# EAGLE schematic XbeeBoard (EAGLE 7.2.0)
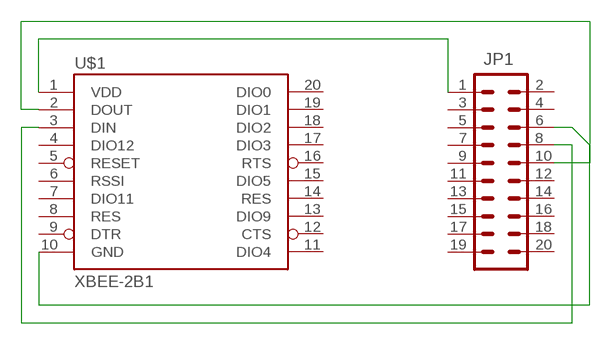
[diagram p0: schematic, sheet 1]

## Parts
JP1  M10X2  [2X10]
U$1  XBEE-2B1  [XBEE-1]

## Nets
N$1: JP1.1 U$1.1(VDD)
N$2: JP1.10 U$1.2(DOUT)
N$3: JP1.8 U$1.3(DIN)
N$4: JP1.6 U$1.10(GND)
Unconnected: JP1.2 JP1.3 JP1.4 JP1.5 JP1.7 JP1.9 JP1.11 JP1.12 JP1.13 JP1.14 JP1.15 JP1.16 JP1.17 JP1.18 JP1.19 JP1.20 U$1.4(DIO12) U$1.5(RESET) U$1.6(RSSI) U$1.7(DIO11) U$1.8(RES) U$1.9(DTR) U$1.11(DIO4) U$1.12(CTS) U$1.13(DIO9) U$1.14(RES) U$1.15(DIO5) U$1.16(RTS) U$1.17(DIO3) U$1.18(DIO2) U$1.19(DIO1) U$1.20(DIO0)

## Library data of the parts
JP1 = SparkFun-Connectors:M10X2: This was SPECIALLY designed to be used with our Graphic LCD Backpack. Be sure you want to use this! It is not only staggered on each line of header holes, but IT IS ALSO offset of the center point of the top and bottom lines by 5 mil. This causes the headers to lock into place on the "standard" footprint on the LCD screen. The extra squares on the tdocu layer are there simply to reference other pins (if you were to actually populate a longer header than ten long - this is what we do with the backpacks).
U$1 = SparkFun-RF:XBEE-2: Xbee module footprints SMT header is CONN-09042.